# Altium schematic sheet CATS-Vega-Pyro_Enable.SchDoc: CATS Vega
size A4; DocumentNumber: Overview; Revision: V1.0; SheetNumber: 9; SheetTotal: 16; Author: Luca Jost; Subtitle: Pyro Power Enable
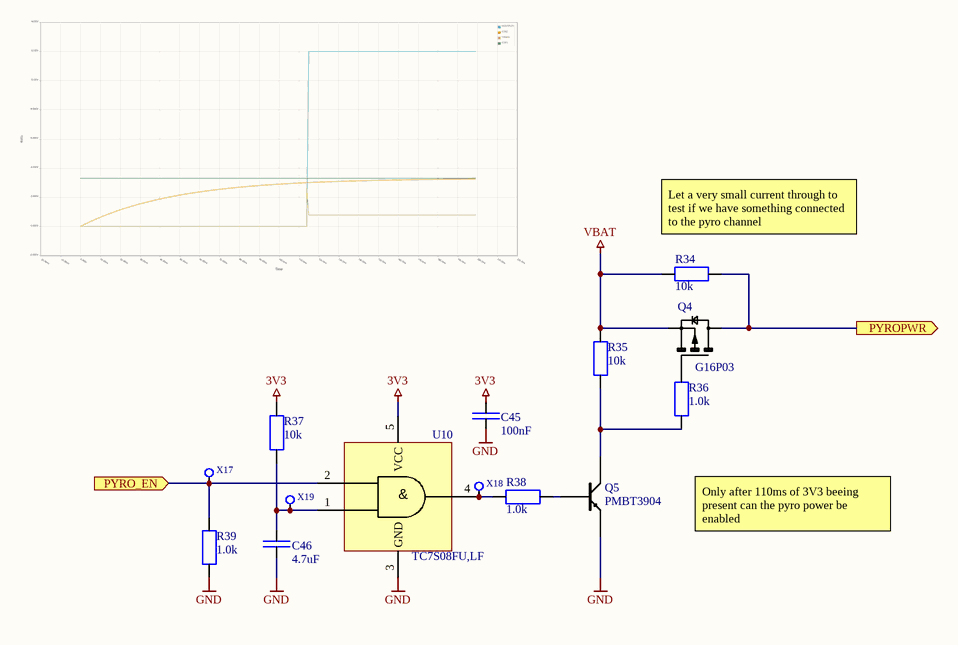
[diagram p0: CATS-Vega-Pyro_Enable.SchDoc]

## Parts
C45  100nF  [SMD Keramikkondensator 0603]
C46  4.7uF  [SMD Keramikkondensator 0603]
Q4  G16P03  [SMD MOSFET DFN 3x3 EP]
Q5  PMBT3904  [SMD Transistor SOT-23]
R34  10k  [SMD Widerstand 0603]
R35  10k  [SMD Widerstand 0603]
R36  1.0k  [SMD Widerstand 0603]
R37  10k  [SMD Widerstand 0603]
R38  1.0k  [SMD Widerstand 0603]
R39  1.0k  [SMD Widerstand 0603]
U10  TC7S08FU,LF  [SMD IC SSOP5-P-0.65A (SOT353-1)]
X17  -  [SMD Test point 0.8mm]  (value not drawn)  (no BOM)
X18  -  [SMD Test point 0.8mm]  (value not drawn)  (no BOM)
X19  -  [SMD Test point 0.8mm]  (value not drawn)  (no BOM)

## Ports
PYRO_EN (in), PYROPWR (out)

## Nets
3V3: C45.2 R37.2 U10.5(VCC)
GND: C45.1 C46.1 Q5.E R39.1 U10.3(GND)
VBAT: Q4.S R34.2 R35.2
PYRO_EN: R39.2 U10.2(IN) X17.1 ; port PYRO_EN
PYROPWR: Q4.D R34.1 ; port PYROPWR
NetC46_2: C46.2 R37.1 U10.1(IN) X19.1
NetQ4_G: Q4.G R36.2
NetQ5_B: Q5.B R38.1
NetQ5_C: Q5.C R35.1 R36.1
NetR38_2: R38.2 U10.4(OUT) X18.1

## Notes on the sheet
- (near R34) Let a very small current through to test if we have something connected to the pyro channel
- Only after 110ms of 3V3 beeing present can the pyro power be enabled
- Title
- Author:
- Subtitle
- Date:
- Rev:
- File:
- Sheet
- of
- (in symbol TC7S08FU,LF) &

## Library data of the parts
C45 = E6 - 100nF: SMD Ceramic Capacitor E6; Unit Price: 0.0024; JLC: C1591
C46 = E6 - 4.7uF: SMD Ceramic Capacitor E6; Unit Price: 0.0082; JLC: C19666
Q4 = G16P03: 30V 16A 35W; ComponentLink1Description: Datasheet; ComponentLink1URL: https://datasheet.lcsc.com/lcsc/1809251724_GOFORD-G16P03_C193982.pdf; JLC: C471913; Unit Price: 0.1535
Q5 = PMBT3904: 40 V, 200 mA NPN switching transisto; ComponentLink1Description: Datasheet; ComponentLink1URL: https://datasheet.lcsc.com/lcsc/2105201004_Nexperia-PMBT3904-215_C8667.pdf; JLC: C8667; Unit Price: 0.019
R34 R35 R37 = E24 - 10k: SMD Chip Resistor E24; Unit Price: 0.001; JLC: C99198
R36 R38 R39 = E24 - 1.0k: SMD Chip Resistor E24; Unit Price: 0.001; JLC: C2907113
U10 = TC7S08FU,LF: AND Gate SSOP5-P-0.65A; ComponentLink1Description: Datasheet; ComponentLink1URL: https://datasheet.lcsc.com/lcsc/1811082031_TOSHIBA-TC7S08FU-LF_C146362.pdf; JLC: C146362; Unit Price: 0.1716
X17-X19 = SMD Test point: Test Point SMD